# EAGLE schematic 1 bit logic block (EAGLE 8.2.1)
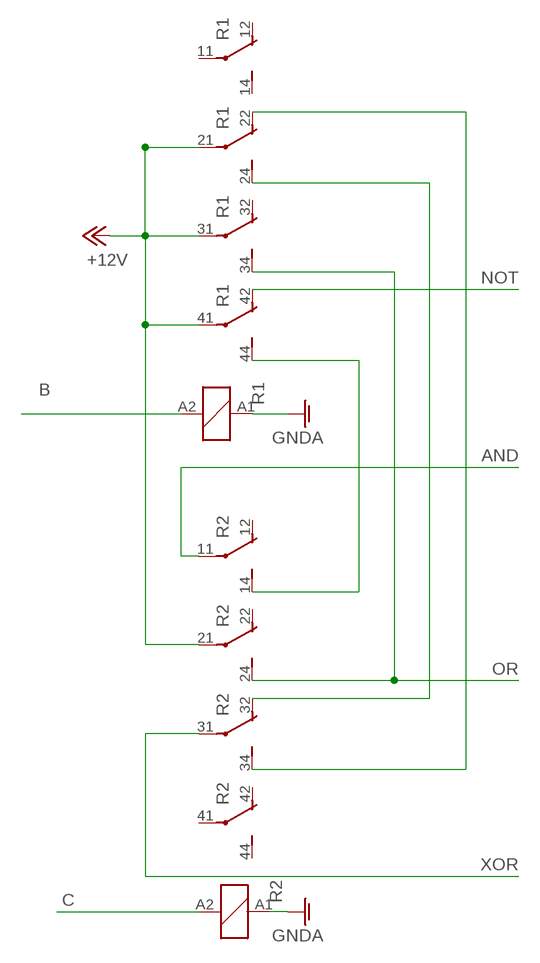
[diagram p0: schematic, sheet 1]

## Parts
R1  PT571R06  [PT-4]
R2  PT571R06  [PT-4]

## Nets
+12V: R1.21(3:P) R1.31(4:P) R1.41(5:P) R2.21(3:P)
AND: R2.11(2:P)
B: R1.A2
C: R2.A2
GNDA: R1.A1 R2.A1
N$1: R1.24(3:S) R2.32(4:O)
N$2: R1.44(5:S) R2.14(2:S)
N$3: R1.22(3:O) R2.34(4:S)
NOT: R1.42(5:O)
OR: R1.34(4:S) R2.24(3:S)
XOR: R2.31(4:P)
Unconnected: R1.11(2:P) R1.12(2:O) R1.14(2:S) R1.32(4:O) R2.12(2:O) R2.22(3:O) R2.41(5:P) R2.42(5:O) R2.44(5:S)

## Library data of the parts
R1 R2 = relay_computer_custom:PT5*: Miniature Relay SCHRACK 2 pole 12 A, 3 pole 10 A or 4 pole 6 A DC- or AC-coil Source: http://www.schrack.com/.. 5823.pdf Socked 78604 Source: http://www.schrack.com/.. 5836.pdf; OC_FARNELL: unknown; OC_NEWARK: unknown